# Altium project PCB_Amp_1.PrjPcb
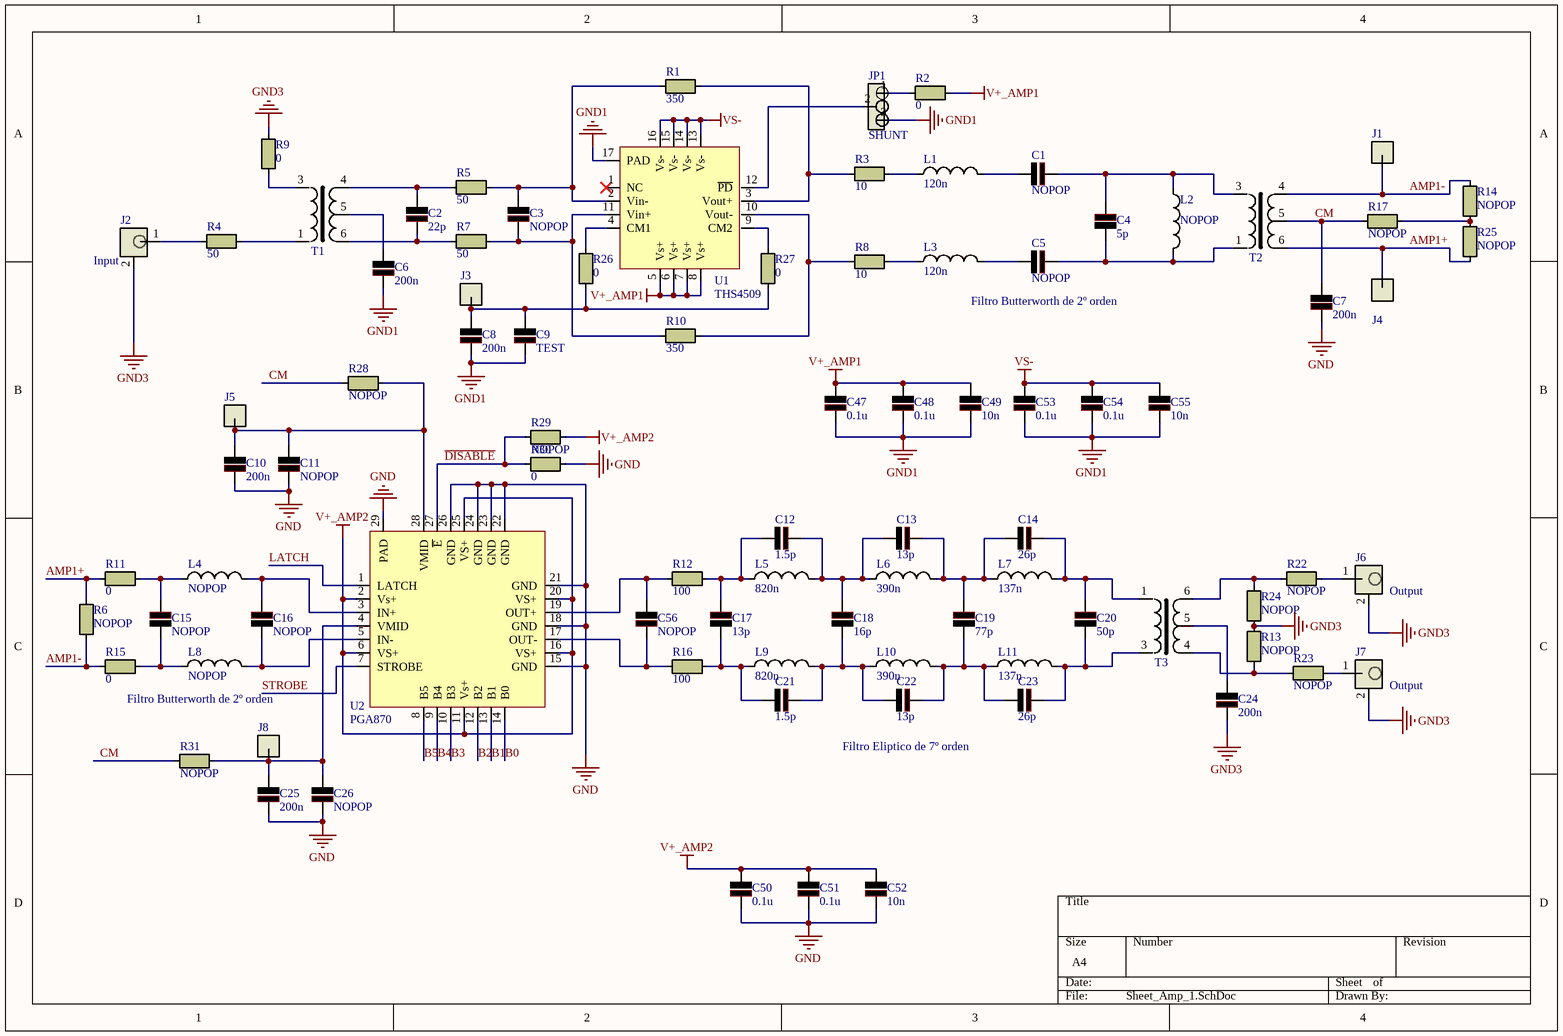
[diagram p0: Sheet_Amp_1.SchDoc]
2 sheets, 143 parts. Net scope: global (net labels, ports and power ports of the same name join across sheets).
Board file: PCB1.PcbDoc
Sheets:
  Sheet_Amp_1.SchDoc
  Sheet_power_1.SchDoc

## Sheet Sheet_Amp_1.SchDoc
size A4

### Parts
C1  NOPOP  [C_0603]
C2  22p  [C_0603]
C3  NOPOP  [C_0603]
C4  5p  [C_0603]
C5  NOPOP  [C_0603]
C6  200n  [C_0603]
C7  200n  [C_0603]
C8  200n  [C_0805]
C9  TEST  [C_0805]
C10  200n  [C_0805]
C11  NOPOP  [C_0805]
C12  1.5p  [C_0603]
C13  13p  [C_0603]
C14  26p  [C_0603]
C15  NOPOP  [C_0603]
C16  NOPOP  [C_0603]
C17  13p  [C_0603]
C18  16p  [C_0603]
C19  77p  [C_0603]
C20  50p  [C_0603]
C21  1.5p  [C_0603]
C22  13p  [C_0603]
C23  26p  [C_0603]
C24  200n  [C_0603]
C25  200n  [C_0805]
C26  NOPOP  [C_0805]
C47  0.1u  [C_0805]
C48  0.1u  [C_0805]
C49  10n  [C_0805]
C50  0.1u  [C_0805]
C51  0.1u  [C_0805]
C52  10n  [C_0805]
C53  0.1u  [C_0805]
C54  0.1u  [C_0805]
C55  10n  [C_0805]
C56  NOPOP  [C_0603]
J1  TEST POINT  [TEST_Point]  (value not drawn)
J2  Input  [BNC]
J3  TEST POINT  [TEST_Point]  (value not drawn)
J4  TEST POINT  [TEST_Point]  (value not drawn)
J5  TEST POINT  [TEST_Point]  (value not drawn)
J6  Output  [SMA]
J7  Output  [SMA]
J8  TEST POINT  [TEST_Point]  (value not drawn)
JP1  SHUNT  [JUMPER_2,54_3]
L1  120n  [L_0603]
L2  NOPOP  [L_0603]
L3  120n  [L_0603]
L4  NOPOP  [L_0603]
L5  820n  [L_0603]
L6  390n  [L_0603]
L7  137n  [L_0603]
L8  NOPOP  [L_0603]
L9  820n  [L_0603]
L10  390n  [L_0603]
L11  137n  [L_0603]
R1  350  [R_0603]
R2  0  [R_0603]
R3  10  [R_0603]
R4  50  [R_0603]
R5  50  [R_0603]
R6  NOPOP  [R_0603]
R7  50  [R_0603]
R8  10  [R_0603]
R9  0  [R_0603]
R10  350  [R_0603]
R11  0  [R_0603]
R12  100  [R_0603]
R13  NOPOP  [R_0603]
R14  NOPOP  [R_0603]
R15  0  [R_0603]
R16  100  [R_0603]
R17  NOPOP  [R_0603]
R22  NOPOP  [R_0603]
R23  NOPOP  [R_0603]
R24  NOPOP  [R_0603]
R25  NOPOP  [R_0603]
R26  0  [R_0603]
R27  0  [R_0603]
R28  NOPOP  [R_0603]
R29  NOPOP  [R_0603]
R30  0  [R_0603]
R31  NOPOP  [R_0603]
T1  ADT1-1WT  [TRASFORMADOR_2.54]  (value not drawn)
T2  ADT1-1WT  [TRASFORMADOR_2.54]  (value not drawn)
T3  ADT1-1WT  [TRASFORMADOR_2.54]  (value not drawn)
U1  THS4509  [QFN_16]
U2  PGA870  [QFN_28]

### Nets
GND: C7.2 C10.2 C11.2 C25.2 C26.2 C50.2 C51.2 C52.2 R30.2 U2.15(GND) U2.18(GND) U2.21(GND) U2.22(GND) U2.23(GND) U2.24(GND) U2.26(GND) U2.29(PAD)
GND1: C6.2 C8.2 C9.2 C47.2 C48.2 C49.2 C53.2 C54.2 C55.2 JP1.3 U1.17(PAD)
GND3: C24.2 J2.2 J6.2 J7.2 R9.2 R13.2 R24.1
V+_AMP1: C47.1 C48.1 C49.1 R2.2 U1.5(Vs+) U1.6(Vs+) U1.7(Vs+) U1.8(Vs+)
V+_AMP2: C50.1 C51.1 C52.1 R29.2 U2.2(Vs+) U2.6(VS+) U2.11(Vs+) U2.16(VS+) U2.20(VS+) U2.25(VS+)
VS-: C53.1 C54.1 C55.1 U1.13(Vs-) U1.14(Vs-) U1.15(Vs-) U1.16(Vs-)
AMP1+: J4.1 R6.2 R11.1 R25.1 T2.6
AMP1-: J1.1 R6.1 R14.2 R15.1 T2.4
B0: U2.14(B0)
B1: U2.13(B1)
B2: U2.12(B2)
B3: U2.10(B3)
B4: U2.9(B4)
B5: U2.8(B5)
CM: C7.1 R17.2 R28.1 R31.1 T2.5
~{DISABLE}: R29.1 R30.1 U2.27(~{E})
LATCH: U2.1(LATCH)
STROBE: U2.7(STROBE)
NetC1_1: C1.1 L1.2
NetC1_2: C1.2 C4.2 L2.1 T2.3
NetC2_1: C2.1 R5.1 T1.4
NetC2_2: C2.2 R7.1 T1.6
NetC3_1: C3.1 R1.1 R5.2 U1.2(Vin-)
NetC3_2: C3.2 R7.2 R10.1 U1.11(Vin+)
NetC4_1: C4.1 C5.2 L2.2 T2.1
NetC5_1: C5.1 L3.2
NetC6_1: C6.1 T1.5
NetC8_1: C8.1 C9.1 J3.1 R26.1 R27.1
NetC10_1: C10.1 C11.1 J5.1 R28.2 U2.28(VMID)
NetC12_1: C12.1 C17.2 L5.1 R12.2
NetC12_2: C12.2 C13.1 C18.2 L5.2 L6.1
NetC13_2: C13.2 C14.1 C19.2 L6.2 L7.1
NetC14_2: C14.2 C20.2 L7.2 T3.1
NetC15_1: C15.1 L8.1 R15.2
NetC15_2: C15.2 L4.1 R11.2
NetC16_1: C16.1 L8.2 U2.5(IN-)
NetC16_2: C16.2 L4.2 U2.3(IN+)
NetC17_1: C17.1 C21.1 L9.1 R16.2
NetC18_1: C18.1 C21.2 C22.1 L9.2 L10.1
NetC19_1: C19.1 C22.2 C23.1 L10.2 L11.1
NetC20_1: C20.1 C23.2 L11.2 T3.3
NetC24_1: C24.1 T3.5
NetC25_1: C25.1 C26.1 J8.1 R31.2 U2.4(VMID)
NetC56_1: C56.1 R12.1 U2.19(OUT+)
NetC56_2: C56.2 R16.1 U2.17(OUT-)
NetJ2_1: J2.1 R4.1
NetJ6_1: J6.1 R22.2
NetJ7_1: J7.1 R23.2
NetJP1_1: JP1.1 R2.1
NetJP1_2: JP1.2 U1.12(~{PD})
NetL1_1: L1.1 R3.2
NetL3_1: L3.1 R8.2
NetR1_2: R1.2 R3.1 U1.3(Vout+)
NetR4_2: R4.2 T1.1
NetR8_1: R8.1 R10.2 U1.10(Vout-)
NetR9_1: R9.1 T1.3
NetR13_1: R13.1 R23.1 T3.4
NetR14_1: R14.1 R17.1 R25.2
NetR22_1: R22.1 R24.2 T3.6
NetR26_2: R26.2 U1.4(CM1)
NetR27_2: R27.2 U1.9(CM2)

Not connected (* = marked no-connect by the designer): U1 1(NC)*

### Notes on the sheet
- Filtro Butterworth de 2º orden
- Filtro Eliptico de 7º orden

### Library data of the parts
C1-C26 C47-C56 = C: Precio: 0,553; Código Mouser: 647-UCL1E331MNL1GS
L1-L11 = L: Precio: 0,59; Código Mouser: 652-SDR1005-331KL
R1-R17 R22-R31 = R: Precio: 0,05; Código Mouser: Variable
T1-T3 = Transformer_center_tab

## Sheet Sheet_power_1.SchDoc
size A4
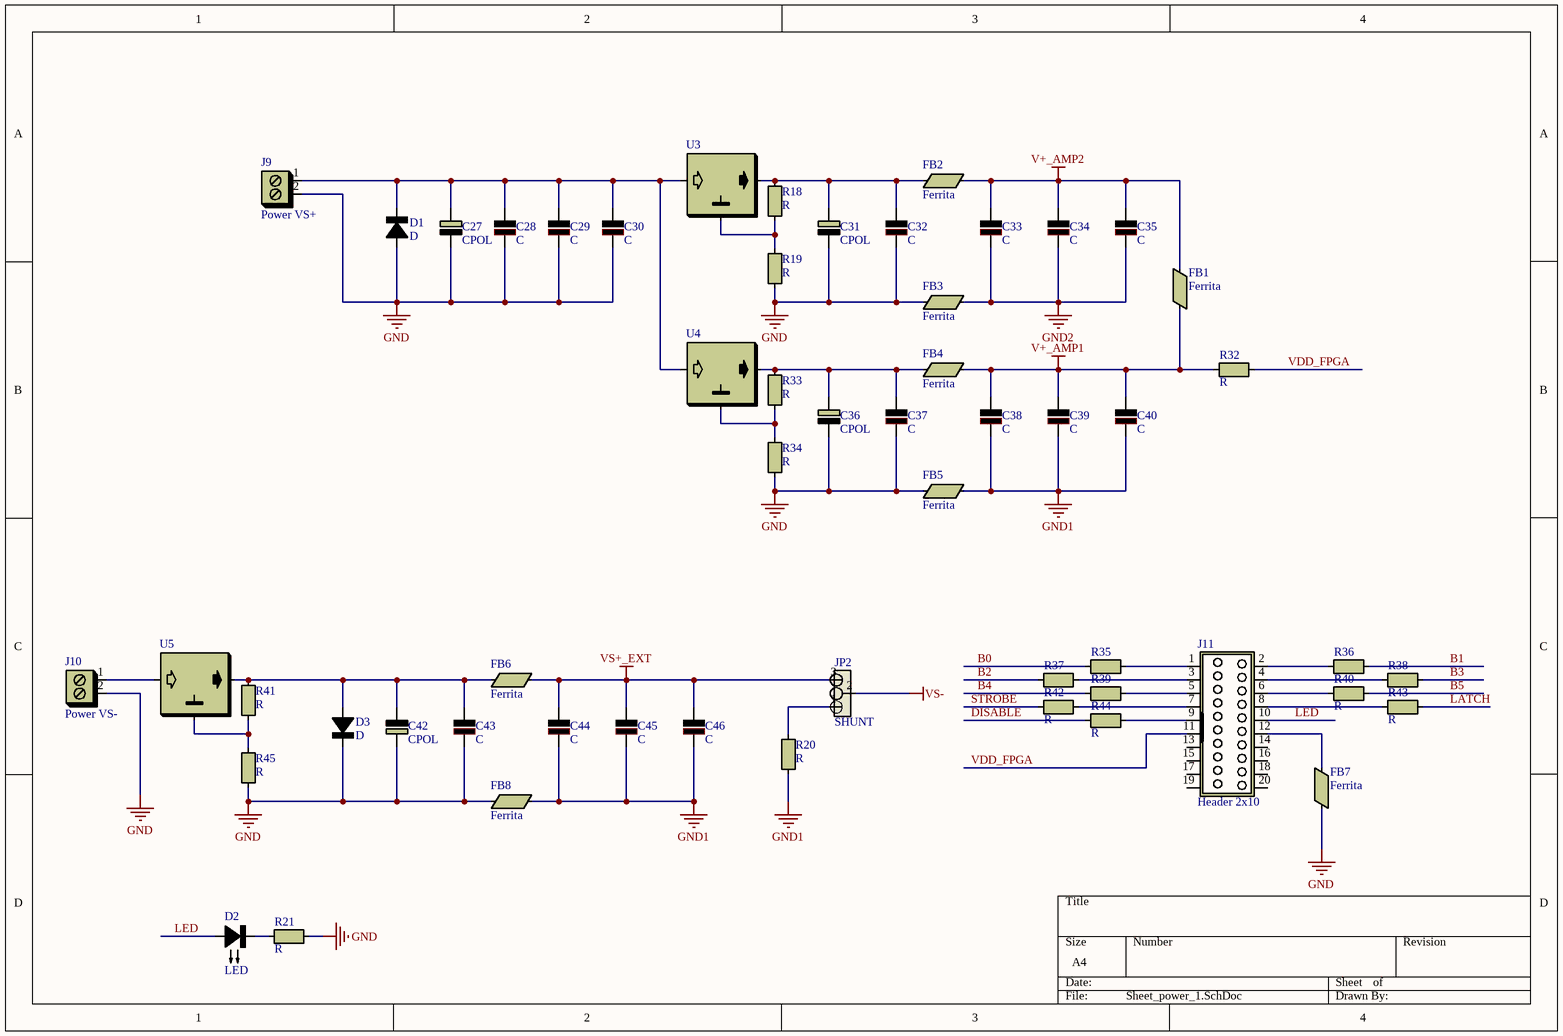
[diagram p1: Sheet_power_1.SchDoc]

### Parts
C27  CPOL  [C_SMD_5.0 x 5.4]
C28  C  [C_0805]
C29  C  [C_0805]
C30  C  [C_0805]
C31  CPOL  [C_SMD_5.0 x 5.4]
C32  C  [C_0805]
C33  C  [C_0805]
C34  C  [C_0805]
C35  C  [C_0805]
C36  CPOL  [C_SMD_5.0 x 5.4]
C37  C  [C_0805]
C38  C  [C_0805]
C39  C  [C_0805]
C40  C  [C_0805]
C42  CPOL  [C_SMD_5.0 x 5.4]
C43  C  [C_0805]
C44  C  [C_0805]
C45  C  [C_0805]
C46  C  [C_0805]
D1  D  [DZENER_0805]
D2  LED  [LED_0805]
D3  D  [DZENER_0805]
FB1  Ferrita  [R_0805]
FB2  Ferrita  [R_0805]
FB3  Ferrita  [R_0805]
FB4  Ferrita  [R_0805]
FB5  Ferrita  [R_0805]
FB6  Ferrita  [R_0805]
FB7  Ferrita  [R_0805]
FB8  Ferrita  [R_0805]
J9  Power VS+  [Borna_PT_2]
J10  Power VS-  [Borna_PT_2]
J11  Header 2x10
JP2  SHUNT  [JUMPER_2,54_3]
R18  R  [R_0603]
R19  R  [R_0603]
R20  R  [R_0603]
R21  R  [R_0603]
R32  R  [R_0603]
R33  R  [R_0603]
R34  R  [R_0603]
R35  R  [R_0603]
R36  R  [R_0603]
R37  R  [R_0603]
R38  R  [R_0603]
R39  R  [R_0603]
R40  R  [R_0603]
R41  R  [R_0603]
R42  R  [R_0603]
R43  R  [R_0603]
R44  R  [R_0603]
R45  R  [R_0603]
U3  VOLTAGE_REGULATOR_3  [REG_DPAK]  (value not drawn)
U4  VOLTAGE_REGULATOR_3  [REG_DPAK]  (value not drawn)
U5  VOLTAGE_REGULATOR_3  [REG_DPAK]  (value not drawn)

### Nets
GND: C27.1 C28.2 C29.2 C30.2 C31.1 C32.2 C36.1 C37.2 C42.2 C43.2 D1.A D3.K FB3.2 FB5.2 FB7.1 FB8.2 J9.2 J10.2 R19.2 R21.2 R34.2 R45.2
GND1: C38.2 C39.2 C40.2 C44.2 C45.2 C46.2 FB5.1 FB8.1 R20.2
GND2: C33.2 C34.2 C35.2 FB3.1
V+_AMP1: C38.1 C39.1 C40.1 FB1.1 FB4.1 R32.1
V+_AMP2: C33.1 C34.1 C35.1 FB1.2 FB2.1
VS+_EXT: C44.1 C45.1 C46.1 FB6.1 JP2.3
VS-: JP2.2
B0: R35.1
B1: R36.2
B2: R37.1
B3: R38.2
B4: R39.1
B5: R40.2
~{DISABLE}: R44.1
LATCH: R43.2
LED: D2.A J11.10
STROBE: R42.1
VDD_FPGA: J11.11 R32.2
NetC27_2: C27.2 C28.1 C29.1 C30.1 D1.K J9.1 U3.IN U4.IN
NetC31_2: C31.2 C32.1 FB2.2 R18.1 U3.OUT
NetC36_2: C36.2 C37.1 FB4.2 R33.1 U4.OUT
NetC42_1: C42.1 C43.1 D3.A FB6.2 R41.1 U5.OUT
NetD2_K: D2.K R21.1
NetFB7_2: FB7.2 J11.12
NetJ10_1: J10.1 U5.IN
NetJ11_1: J11.1 R35.2
NetJ11_2: J11.2 R36.1
NetJ11_3: J11.3 R37.2
NetJ11_4: J11.4 R38.1
NetJ11_5: J11.5 R39.2
NetJ11_6: J11.6 R40.1
NetJ11_7: J11.7 R42.2
NetJ11_8: J11.8 R43.1
NetJ11_9: J11.9 R44.2
NetJP2_1: JP2.1 R20.1
NetR18_2: R18.2 R19.1 U3.GND
NetR33_2: R33.2 R34.1 U4.GND
NetR41_2: R41.2 R45.1 U5.GND

Not connected (* = marked no-connect by the designer): J11 13 14 15 16 17 18 19 20

### Library data of the parts
C27 C31 C36 C42 = CPOL: Precio: 0,553; Código Mouser: 647-UCL1E331MNL1GS
C28-C30 C32-C35 C37-C40 C43-C46 = C: Precio: 0,553; Código Mouser: 647-UCL1E331MNL1GS
D1 D3 = D: Precio: 0,312; Código Mouser: 583-SM4007
D2 = LED: Precio: 0,099; Código Mouser: 859-LTST-S220EKT
J9 J10 = BORNA_2: Precio: 0,95; Código Mouser: 571-1977477-2
R18-R21 R32-R45 = R: Precio: 0,05; Código Mouser: Variable
U3-U5 = VOLTAGE_REGULATOR_3: Precio: 0,71; Código Mouser: 511-L7805CD2T-TR

## Nets that join several sheets
GND: Sheet_Amp_1 (17 pins), Sheet_power_1 (22 pins)
GND1: Sheet_Amp_1 (11 pins), Sheet_power_1 (9 pins)
V+_AMP1: Sheet_Amp_1 (8 pins), Sheet_power_1 (6 pins)
V+_AMP2: Sheet_Amp_1 (10 pins), Sheet_power_1 (5 pins)
VS-: Sheet_Amp_1 (7 pins), Sheet_power_1 (JP2.2)
B0: Sheet_Amp_1 (U2.14), Sheet_power_1 (R35.1)
B1: Sheet_Amp_1 (U2.13), Sheet_power_1 (R36.2)
B2: Sheet_Amp_1 (U2.12), Sheet_power_1 (R37.1)
B3: Sheet_Amp_1 (U2.10), Sheet_power_1 (R38.2)
B4: Sheet_Amp_1 (U2.9), Sheet_power_1 (R39.1)
B5: Sheet_Amp_1 (U2.8), Sheet_power_1 (R40.2)
~{DISABLE}: Sheet_Amp_1 (R29.1 R30.1 U2.27), Sheet_power_1 (R44.1)
LATCH: Sheet_Amp_1 (U2.1), Sheet_power_1 (R43.2)
STROBE: Sheet_Amp_1 (U2.7), Sheet_power_1 (R42.1)